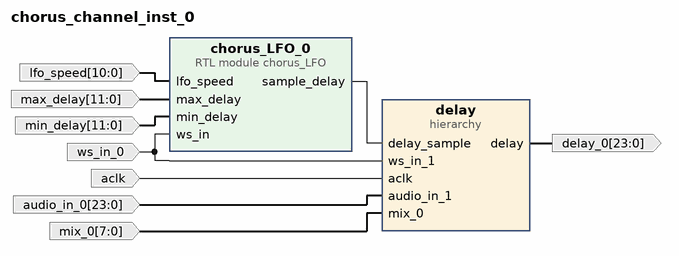
[diagram p0: block diagram of the top level]
# Vivado block design chorus_channel_inst_0, xc7a100tcsg324-1, Vivado 2022.1
create_bd_design chorus_channel_inst_0

create_bd_port -dir I -from 23 -to 0 audio_in_0
create_bd_port -dir I ws_in_0
create_bd_port -dir I -type clk aclk
create_bd_port -dir I -from 7 -to 0 mix_0
create_bd_port -dir O -from 23 -to 0 delay_0
create_bd_port -dir I -from 11 -to 0 min_delay
create_bd_port -dir I -from 11 -to 0 max_delay
create_bd_port -dir I -from 10 -to 0 lfo_speed

create_bd_cell -type hier delay
create_bd_cell -type module -reference chorus_LFO chorus_LFO_0

# ---- hierarchy /delay ----
current_bd_instance /delay
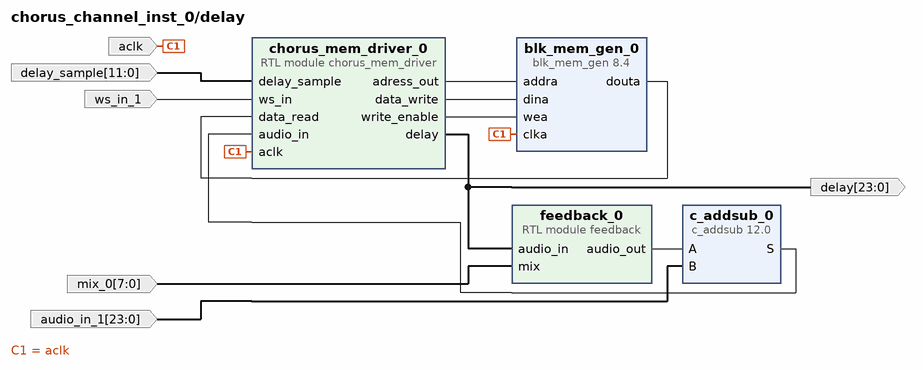
[diagram p1: block diagram inside /delay]
create_bd_pin -dir I aclk
create_bd_pin -dir I ws_in_1
create_bd_pin -dir I -from 23 -to 0 audio_in_1
create_bd_pin -dir O -from 23 -to 0 delay
create_bd_pin -dir I -from 7 -to 0 mix_0
create_bd_pin -dir I -from 11 -to 0 delay_sample

create_bd_cell -type module -reference feedback feedback_0
create_bd_cell -type ip -vlnv xilinx.com:ip:blk_mem_gen:8.4 blk_mem_gen_0
set_property -dict [list \
  CONFIG.Enable_32bit_Address false \
  CONFIG.Enable_A Always_Enabled \
  CONFIG.Operating_Mode_A NO_CHANGE \
  CONFIG.Read_Width_A 24 \
  CONFIG.Register_PortA_Output_of_Memory_Primitives true \
  CONFIG.Use_Byte_Write_Enable false \
  CONFIG.Use_RSTA_Pin false \
  CONFIG.Write_Depth_A 4096 \
  CONFIG.Write_Width_A 24 \
  CONFIG.use_bram_block Stand_Alone \
] [get_bd_cells blk_mem_gen_0]
create_bd_cell -type ip -vlnv xilinx.com:ip:c_addsub:12.0 c_addsub_0
set_property -dict [list \
  CONFIG.A_Type Signed \
  CONFIG.A_Width 24 \
  CONFIG.B_Type Signed \
  CONFIG.B_Value 000000000000000000000000 \
  CONFIG.B_Width 24 \
  CONFIG.CE false \
  CONFIG.Latency 0 \
  CONFIG.Out_Width 24 \
] [get_bd_cells c_addsub_0]
create_bd_cell -type module -reference chorus_mem_driver chorus_mem_driver_0
set_property -dict {CONFIG.max_delay 8096} [get_bd_cells chorus_mem_driver_0]

# ---- connections ----

current_bd_instance /delay
connect_bd_net [get_bd_pins aclk] [get_bd_pins blk_mem_gen_0/clka] [get_bd_pins chorus_mem_driver_0/aclk]
connect_bd_net -net audio_in_1_1 [get_bd_pins audio_in_1] [get_bd_pins c_addsub_0/B]
connect_bd_net [get_bd_pins blk_mem_gen_0/douta] [get_bd_pins chorus_mem_driver_0/data_read]
connect_bd_net [get_bd_pins c_addsub_0/S] [get_bd_pins chorus_mem_driver_0/audio_in]
connect_bd_net [get_bd_pins chorus_mem_driver_0/adress_out] [get_bd_pins blk_mem_gen_0/addra]
connect_bd_net [get_bd_pins chorus_mem_driver_0/data_write] [get_bd_pins blk_mem_gen_0/dina]
connect_bd_net [get_bd_pins chorus_mem_driver_0/delay] [get_bd_pins feedback_0/audio_in] [get_bd_pins delay]
connect_bd_net [get_bd_pins chorus_mem_driver_0/write_enable] [get_bd_pins blk_mem_gen_0/wea]
connect_bd_net [get_bd_pins delay_sample] [get_bd_pins chorus_mem_driver_0/delay_sample]
connect_bd_net [get_bd_pins feedback_0/audio_out] [get_bd_pins c_addsub_0/A]
connect_bd_net -net mix_0_1 [get_bd_pins mix_0] [get_bd_pins feedback_0/mix]
connect_bd_net -net ws_in_1_1 [get_bd_pins ws_in_1] [get_bd_pins chorus_mem_driver_0/ws_in]

current_bd_instance /
connect_bd_net [get_bd_ports aclk] [get_bd_pins delay/aclk]
connect_bd_net -net audio_in_0_1 [get_bd_ports audio_in_0] [get_bd_pins delay/audio_in_1]
connect_bd_net [get_bd_pins chorus_LFO_0/sample_delay] [get_bd_pins delay/delay_sample]
connect_bd_net [get_bd_pins delay/delay] [get_bd_ports delay_0]
connect_bd_net [get_bd_ports lfo_speed] [get_bd_pins chorus_LFO_0/lfo_speed]
connect_bd_net [get_bd_ports max_delay] [get_bd_pins chorus_LFO_0/max_delay]
connect_bd_net [get_bd_ports min_delay] [get_bd_pins chorus_LFO_0/min_delay]
connect_bd_net -net mix_0_1 [get_bd_ports mix_0] [get_bd_pins delay/mix_0]
connect_bd_net -net ws_in_0_1 [get_bd_ports ws_in_0] [get_bd_pins delay/ws_in_1] [get_bd_pins chorus_LFO_0/ws_in]

validate_bd_design
save_bd_design
